# EAGLE design Environment Sensor (EAGLE 6.4)
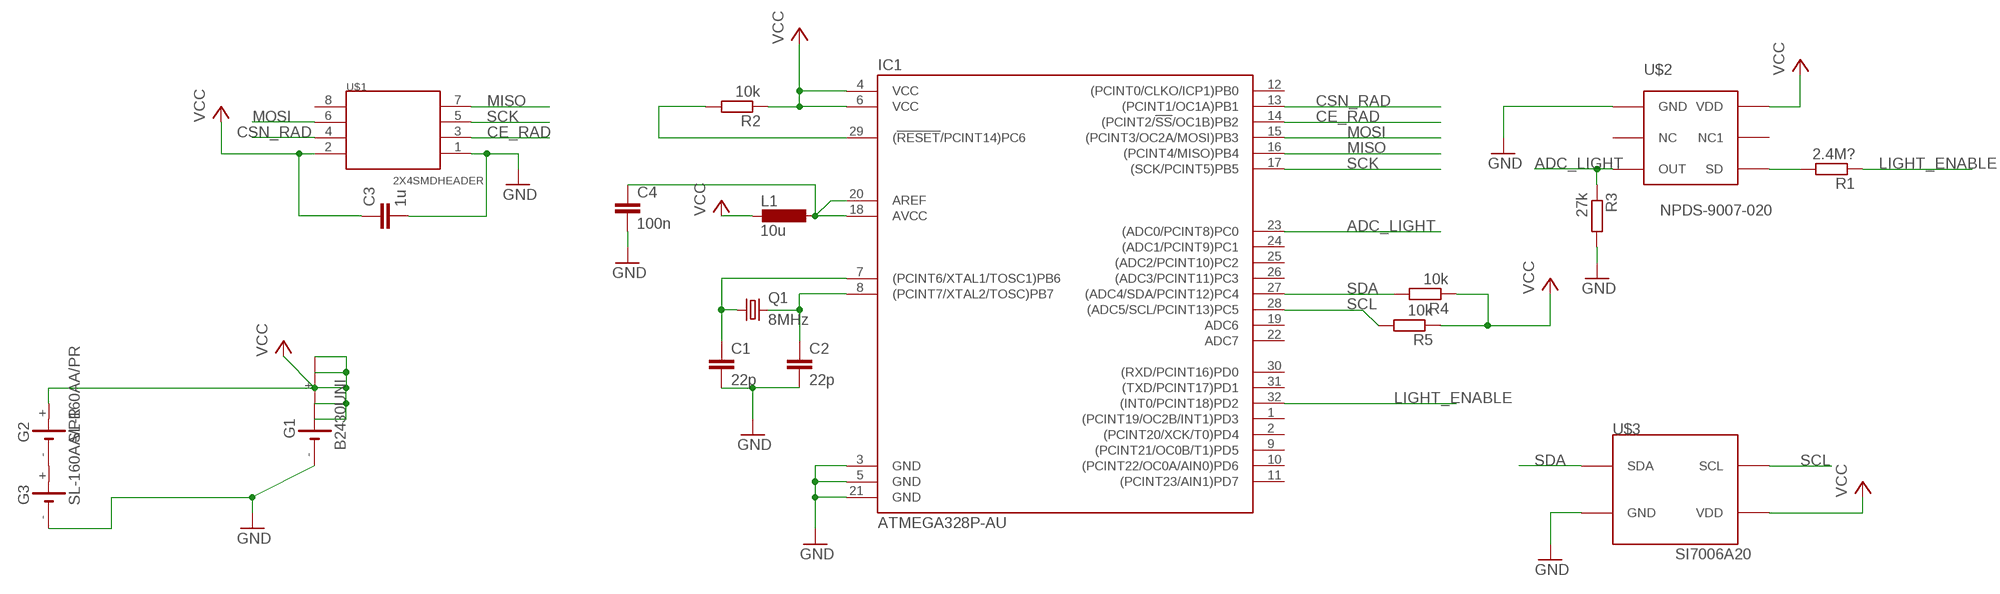
[diagram p0: schematic, sheet 1]

## Parts
C1  22p  C-EUC1206K  [C1206K]
C2  22p  C-EUC1206K  [C1206K]
C3  1u  C-EUC1206K  [C1206K]
C4  100n  C-EUC1206  [C1206]
G1  B2430UNI  [B2430UNI]
G2  SL-160AA/PR  [SL-160AA/PR]
G3  SL-160AA/PR  [SL-160AA/PR]
IC1  ATMEGA328P-AU  [TQFP32-08]
L1  10u  L-EUL3216C  [L3216C]
Q1  8MHz  CRYSTALHC49UP  [HC49UP]
R1  2.4M?  R-EU_R1206  [R1206]
R2  10k  R-EU_R1206  [R1206]
R3  27k  R-EU_R1206  [R1206]
R4  10k  R-EU_R1206  [R1206]
R5  10k  R-EU_R1206  [R1206]
U$1  2X4SMDHEADER  [TSM-110-XX-XXX-DV]
U$2  NPDS-9007-020  [APDS-9007]
U$3  SI7006A20  [3X3DFN]

## Nets
ADC_LIGHT: IC1.23((ADC0/PCINT8)PC0) R3.1 U$2.P$3(OUT)
CE_RAD: IC1.14((PCINT2/!SS!/OC1B)PB2) U$1.3
CSN_RAD: IC1.13((PCINT1/OC1A)PB1) U$1.4
GND: C1.2 C2.2 C3.2 C4.2 G1.- G3.- IC1.3(GND) IC1.5(GND) IC1.21(GND) R3.2 U$1.1 U$2.P$1(GND) U$3.P$2(GND)
LIGHT_ENABLE: IC1.32((INT0/PCINT18)PD2) R1.1
MISO: IC1.16((PCINT4/MISO)PB4) U$1.7
MOSI: IC1.15((PCINT3/OC2A/MOSI)PB3) U$1.6
N$1: C1.1 IC1.7((PCINT6/XTAL1/TOSC1)PB6) Q1.1
N$2: C2.1 IC1.8((PCINT7/XTAL2/TOSC)PB7) Q1.2
N$3: IC1.29((!RESET!/PCINT14)PC6) R2.2
N$4: G2.- G3.+
N$5: R1.2 U$2.P$6(SD)
N$8: C4.1 IC1.18(AVCC) IC1.20(AREF) L1.1
SCK: IC1.17((SCK/PCINT5)PB5) U$1.5
SCL: IC1.28((ADC5/SCL/PCINT13)PC5) R5.2 U$3.P$6(SCL)
SDA: IC1.27((ADC4/SDA/PCINT12)PC4) R4.2 U$3.P$1(SDA)
VCC: C3.1 G1.+ G1.+@1(+) G1.+@2(+) G1.+@3(+) G1.+@4(+) G2.+ IC1.4(VCC) IC1.6(VCC) L1.2 R2.1 R4.1 R5.1 U$1.2 U$2.P$4(VDD) U$3.P$5(VDD)
Unconnected: G1.-@1(-) IC1.1((PCINT19/OC2B/INT1)PD3) IC1.2((PCINT20/XCK/T0)PD4) IC1.9((PCINT21/OC0B/T1)PD5) IC1.10((PCINT22/OC0A/AIN0)PD6) IC1.11((PCINT23/AIN1)PD7) IC1.12((PCINT0/CLKO/ICP1)PB0) IC1.19(ADC6) IC1.22(ADC7) IC1.24((ADC1/PCINT9)PC1) IC1.25((ADC2/PCINT10)PC2) IC1.26((ADC3/PCINT11)PC3) IC1.30((RXD/PCINT16)PD0) IC1.31((TXD/PCINT17)PD1) U$1.8 U$2.P$2(NC) U$2.P$5(NC1)

## Library data of the parts
C1-C4 = rcl:C-EU: CAPACITOR, European symbol
G1 = battery:B2430UNI: LI BATTERY
G2 G3 = battery:SL-160AA/PR: LI BATTERY Sonnenschein
IC1 = ATMEGA328P:ATMEGA328P-
L1 = rcl:L-EU: INDUCTOR, European symbol
Q1 = crystal:CRYSTAL: CRYSTAL; OC_FARNELL: unknown; OC_NEWARK: unknown
R1-R5 = rcl:R-EU_: RESISTOR, European symbol
U$1 = Header:2X4SMDHEADER
U$2 = APDS:NPDS-9007-020
U$3 = Si7006:SI7006

## Board
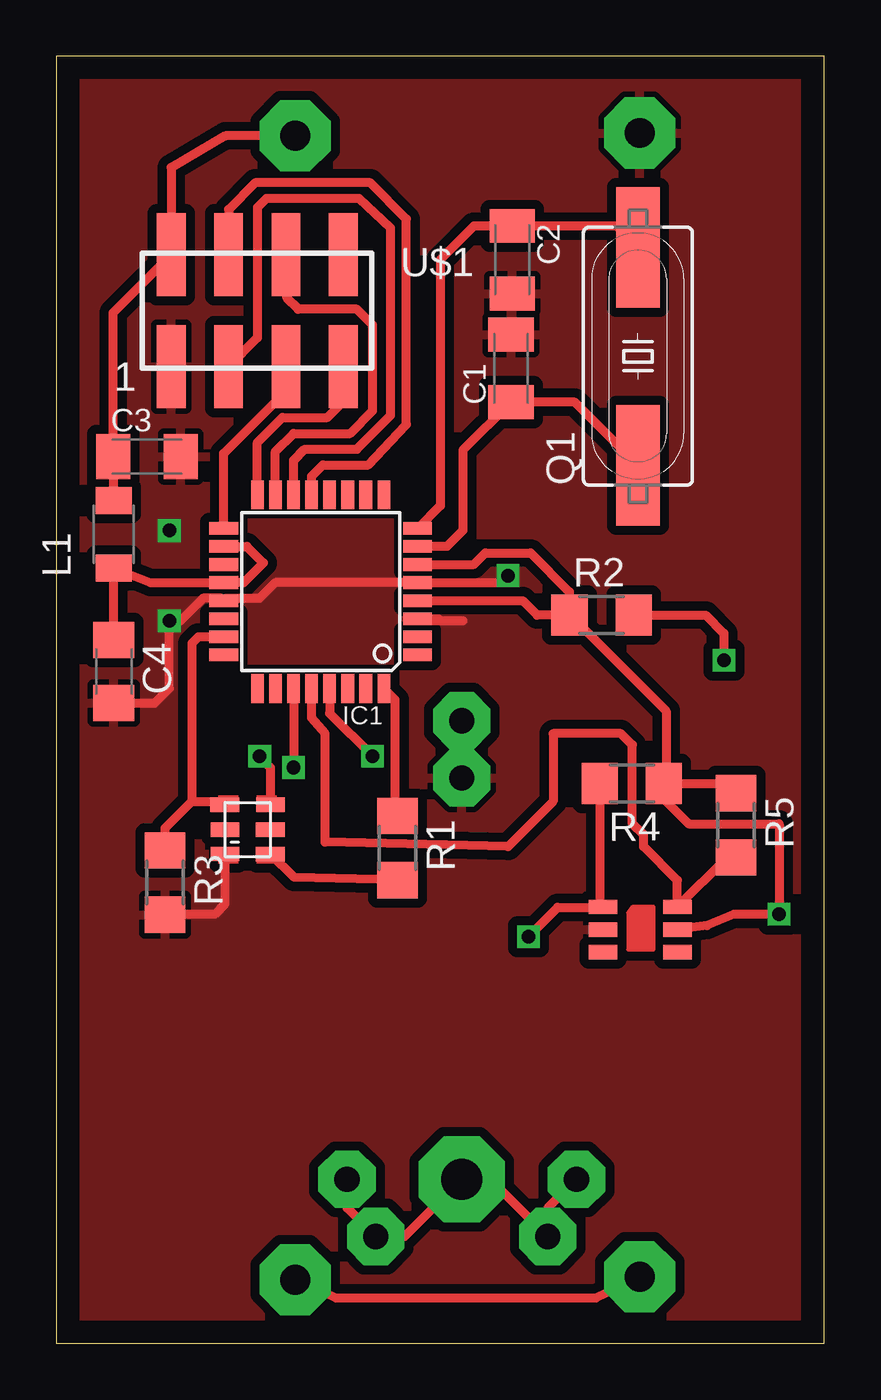
[diagram p1: board, top side]
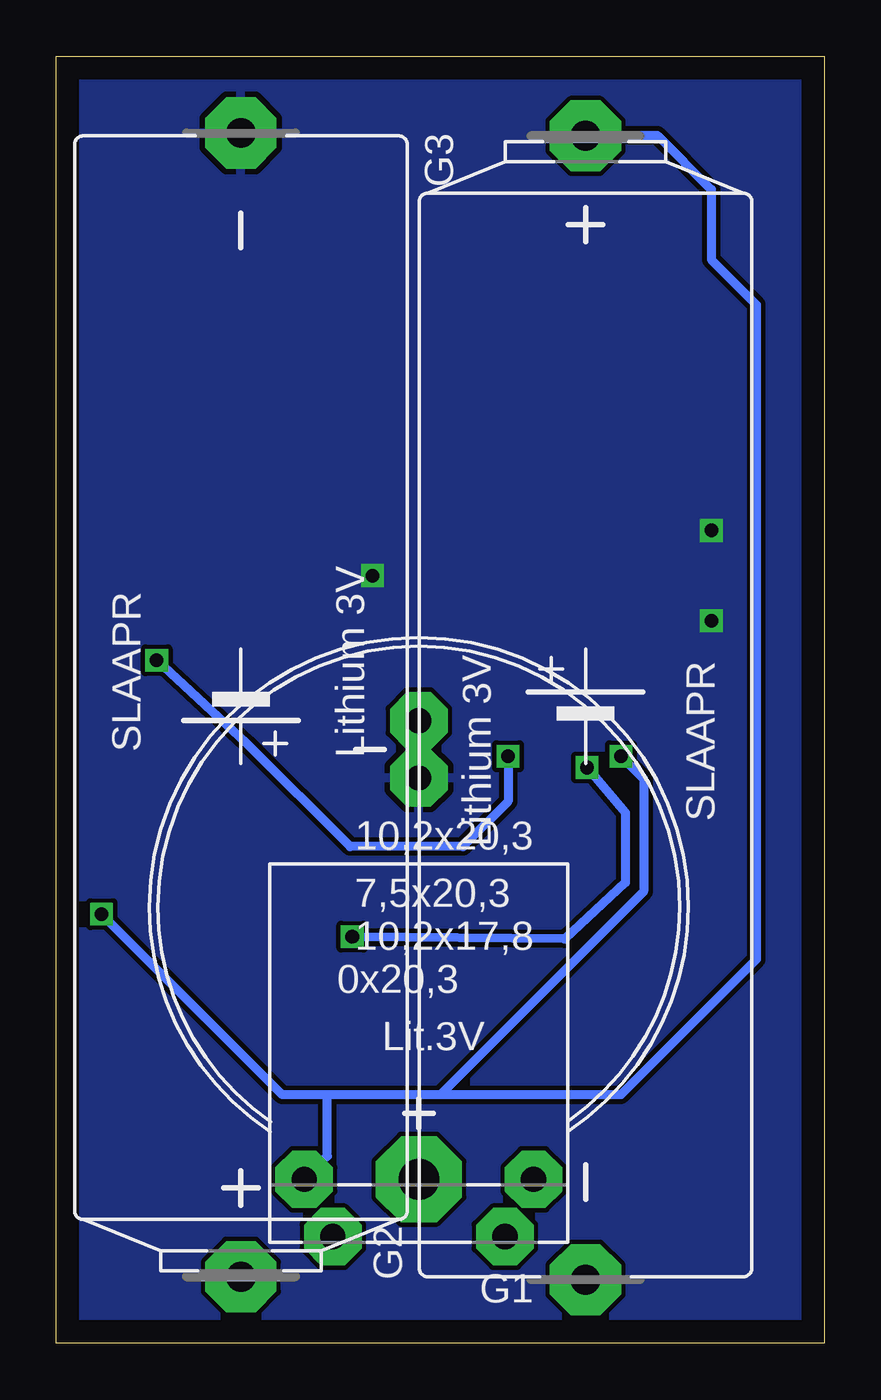
[diagram p2: board, bottom side, seen from below]

Size 34 x 57 mm. Coordinates in mm from the lower left corner, seen from the top.
Outline: 0,0 34,0 34,57 0,57 0,0
Copper layers (1*16): Top 0.035mm / dielectric 1.5mm / Bottom 0.035mm
Design rules "default": minimum track width 10mil, minimum drill 24mil, track to track 8mil, track to pad 8mil, pad to pad 8mil, via to via 8mil, smd to smd 8mil, copper to edge 40mil, drill to drill 8mil, minimum pad ring 10mil, minimum via ring 8mil, stop-mask expansion 4mil, vias tented up to drill 0mil, thermal gap 10mil

### Footprints (pad centres in the part's own frame; a part is rotated, then mirrored left to right if it is on the bottom)
C1206K = smd 1.5 x 2: 1 -1.5,0; 2 1.5,0
C1206 = smd 1.6 x 1.8: 1 -1.4,0; 2 1.4,0
B2430UNI = drill 1.118 pad 2.54 octagon: + 3.81,14.605; +@1 -3.81,14.605; +@2 -5.08,12.065; +@3 5.08,12.065; - 0,-5.715; -@1 0,-8.255 | drill 1.803 pad 3.81 octagon: +@4 0,12.065
SL-160AA/PR = drill 1.321 pad 3.15 octagon: + 25.273,0; - -25.4,0
TQFP32-08 = smd 1.27 x 0.559: 1 -4.293,2.8; 2 -4.293,2; 3 -4.293,1.2; 4 -4.293,0.4; 5 -4.293,-0.4; 6 -4.293,-1.2; 7 -4.293,-2; 8 -4.293,-2.8; 17 4.293,-2.8; 18 4.293,-2; 19 4.293,-1.2; 20 4.293,-0.4; 21 4.293,0.4; 22 4.293,1.2; 23 4.293,2; 24 4.293,2.8 | smd 0.559 x 1.27: 9 -2.8,-4.293; 10 -2,-4.293; 11 -1.2,-4.293; 12 -0.4,-4.293; 13 0.4,-4.293; 14 1.2,-4.293; 15 2,-4.293; 16 2.8,-4.293; 25 2.8,4.293; 26 2,4.293; 27 1.2,4.293; 28 0.4,4.293; 29 -0.4,4.293; 30 -1.2,4.293; 31 -2,4.293; 32 -2.8,4.293
L3216C = smd 1.2 x 1.6: 1 -1.5,0; 2 1.5,0
HC49UP = smd 5.334 x 1.93: 1 -4.826,0; 2 4.826,0
R1206 = smd 1.6 x 1.803: 1 -1.422,0; 2 1.422,0
TSM-110-XX-XXX-DV = smd 1.27 x 3.683: 1 -3.81,-2.731; 2 -3.81,2.223; 3 -1.27,-2.731; 4 -1.27,2.223; 5 1.27,-2.731; 6 1.27,2.223; 7 3.81,-2.731; 8 3.81,2.223
APDS-9007 = smd 0.635 x 1.27: P$1 -2.28,2; P$2 -1.2,2; P$3 -0.1,2.01; P$4 -0.1,-0.02; P$5 -1.2,-0.01; P$6 -2.29,-0.01
3X3DFN = smd 1.27 x 0.635: P$1 -0.2,0; P$2 -0.2,-1; P$3 -0.2,-2; P$4 3.1,-2; P$5 3.1,-1; P$6 3.1,0

### Placement (x,y rotation side)
C1  20.13,43.18 90 top
C2  20.19,47.99 270 top
C3  4.01,39.27 0 top
C4  2.54,29.75 270 top
G1  17.95,19.32 180 bottom
G2  10.57,28.21 90 bottom
G3  25.83,28.21 270 bottom
IC1  11.7,33.29 180 top
L1  2.54,35.83 90 top
Q1  25.75,43.72 90 top
R1  15.1,21.93 270 top
R2  24.14,32.25 0 top
R3  4.81,20.4 270 top
R4  25.48,24.79 180 top
R5  30.1,22.94 270 top
U$1  8.89,45.99 0 top
U$2  9.46,23.95 90 top
U$3  24.4,19.32 0 top

### Tracks (layer width: path | path; a pad name or v marks a point on that pad's centre or on a via)
ADC_LIGHT
  Top 0.406: R3.1 4.81,22.81 6,24 | 6,24 7.3,24 U$2.P$3 | IC1.23 6.29,31.29 6,31 6,24
CE_RAD
  Top 0.406: U$1.3 8.9,44.54 8.9,50.3 9.3,50.7 13.4,50.7 14.8,49.4 14.8,41.1 13.3,39.6 11,39.6 10.5,39.1 IC1.14
CSN_RAD
  Top 0.406: IC1.13 11.3,38.4 11.8,38.9 13.8,38.9 15.5,40.7 15.5,49.8 13.9,51.4 8.8,51.4 7.62,50.22 U$1.4
GND  (via drill 0.6)
  Top 0.406: 18,32 16.08,32 IC1.3 16.91,32.09 | U$2.P$1 7.46,19.46 7,19 4.83,19 R3.2 | v20,34 19.69,33.69 IC1.5 9.69,33.69 9,33 7.52,33 IC1.21 7.3,33 6.5,33 5.5,32 v5,32 5,29 4.35,28.35 C4.2
  other vias: 5,36
  pour Top (isolate 0.406): -1,58.23 -3.62,58.23 -2.62,-1.27 34.01,-1.27 34.01,58.04 -1,58.04
  pour Bottom: -3,60 -3,-1 34,-1 34,60
LIGHT_ENABLE
  Top 0.406: IC1.32 15,28.5 15,23.35 R1.1
MISO
  Top 0.406: IC1.16 8.9,39.9 10,41 12,41 12.7,41.7 U$1.7
MOSI
  Top 0.406: IC1.15 9.7,39.5 10.5,40.3 13,40.3 14,41.3 14,45.1 13.3,45.8 10.7,45.8 10.2,46.3 10.2,48.17 U$1.6
N$1
  Top 0.406: Q1.1 22.96,41.68 C1.1 18,39.55 18,36 17.29,35.29 IC1.7
N$2
  Top 0.406: Q1.2 24.81,49.49 C2.1 18.49,49.49 17,48 17,37.1 IC1.8
N$3  (via drill 0.6)
  Top 0.406: R2.2 28.75,32.25 29.56,31.44 v29.56,30.25 | IC1.29 12.1,27.9 v14,26
  Bottom 0.406: v14,26 14,24 16,22 21,22 25.56,26.56 v29.56,30.25
N$4
  Top 0.406: G2.- 12.38,2 23.89,2 G3.+
N$5
  Top 0.406: R1.2 10.54,20.63 U$2.P$6
N$8
  Top 0.406: IC1.18 8.43,35.29 9.16,34.56 8.29,33.69 IC1.20 4.18,33.69 L1.1 C4.1
SCK
  Top 0.406: IC1.17 7.41,39.41 10,42 10,43.1 U$1.5
SCL
  Top 0.406: R5.2 29.7,21.52 U$3.P$6 27.5,20.5 26,22 26,22.5 25.5,23 25.5,26.5 25,27 22,27 22,24 20,22 11.9,22.2 11.9,27 11.3,27.7 IC1.28
SDA  (via drill 0.6)
  Top 0.406: R4.2 24.06,19.46 U$3.P$1 24.18,19.3 22.2,19.3 v20.9,18 | IC1.27 v10.5,25.5
  Bottom 0.406: v10.5,25.5 8.8,23.5 8.8,20.4 11.5,17.9 v20.9,18
VCC  (via drill 0.6)
  Top 0.406: IC1.4 20.64,32.89 21.28,32.25 R2.1 | R4.1 27,24.89 27,28 22.75,32.25 R2.1 | R4.1 29.67,24.79 R5.1 | G2.+ 7.48,53.48 5.08,52.08 U$1.2 2.51,45.64 C3.1 2.54,39.24 L1.2 | R4.1 26.9,24.1 28,23 32,23 v32,19 30,19 28.82,18.5 U$3.P$5 | G1.+@2 12.87,5.99 G1.+@1 15.41,4.71 G1.+@4 19.22,7.26 G1.+ 21.76,5.99 G1.+@3 | U$2.P$4 9.48,25.48 v9,26 | IC1.6 18.49,34.49 19,35 21,35 22.72,33.28 R2.1
  Bottom 0.406: v9,26 8,25 8,20 17,11 | 17,11 22,11 | 22,11 24,11 v32,19 | G2.+ 10.55,53.5 7.4,53.5 5,51.1 5,48 3,46 3,17 9,11 17,11 | 22,11 22,8.29 G1.+@3